# EasyEDA Pro project TY-PCB.eprj

# Schematic Schematic1
Create Date: 2023-03-30; Page Name: P1; Project Name: TY-PCB; Schematic Name: Schematic1; Update Date: 2023-04-24; Company: 嘉立创EDA; Page Size: A4; Version: V1.0
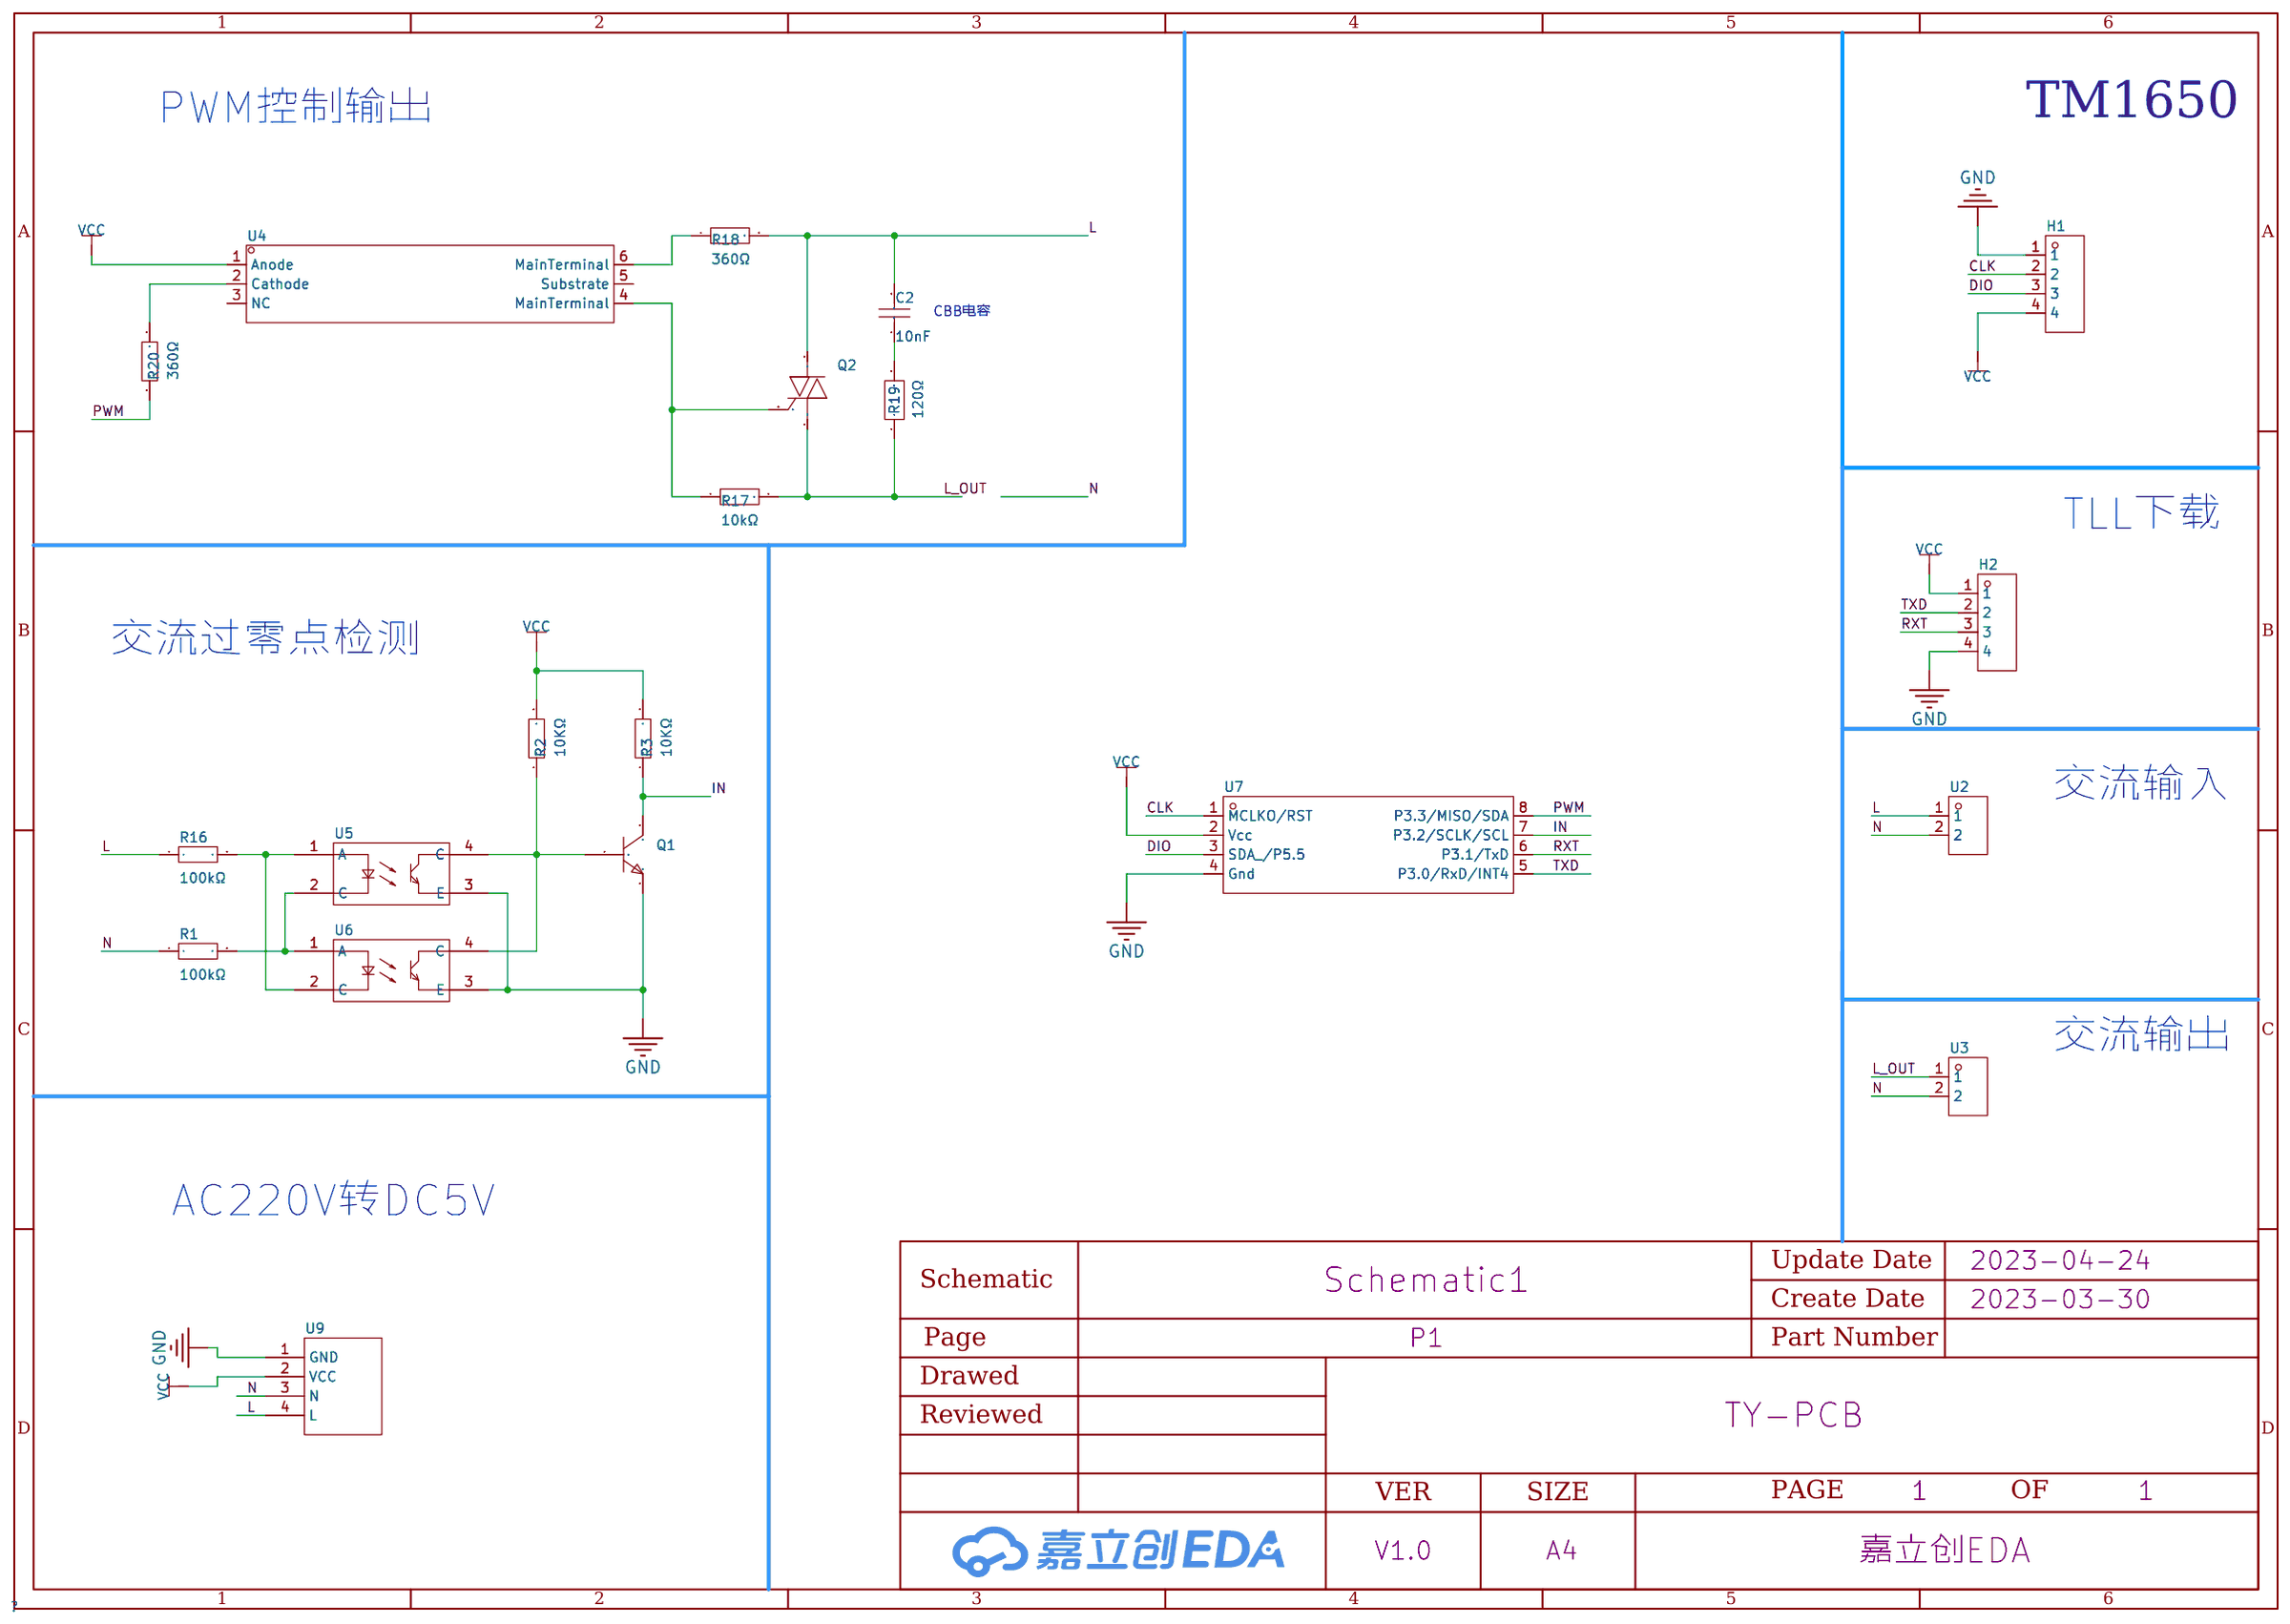
[diagram p0: schematic sheet]

## Parts
C2  10nF  [CAP-TH_L13.0-W6.0-P10.00-D1.2]
H1  826629-4  [HDR-TH_4P-P2.54-V-M-1]
H2  826629-4  [HDR-TH_4P-P2.54-V-M-1]
Q1  S8050  [TO-92-3_L4.9-W3.7-P1.27-L]
Q2  BTA06-800B  [TO-220-3_L10.0-W4.5-P2.54-L]
R1  100kΩ  [R1210]
R2  10KΩ  [R0805]
R3  10KΩ  [R0805]
R16  100kΩ  [R1210]
R17  10kΩ  [R1210]
R18  360Ω  [R1210]
R19  120Ω  [R2512]
R20  360Ω  [R0805]
U2  DB302-5.0-2P-GN-S  [CONN-TH_DB302-5.0-2P]
U3  DB302-5.0-2P-GN-S  [CONN-TH_DB302-5.0-2P]
U4  MOC3052S-V  [SOP-6_L8.5-W6.4-P2.54-LS9.2-BL]
U5  TLP521-1XGBSMT&R  [SOP-4_L6.4-W4.6-P2.54-LS10.2-BL]
U6  TLP521-1XGBSMT&R  [SOP-4_L6.4-W4.6-P2.54-LS10.2-BL]
U7  STC8G1K08-36I-SOP8  [SOP-8_L5.0-W4.0-P1.27-LS6.0-BL]
U9  -  [220V-5V]

## Library data of the parts
C2 = MPP103J2J1304075LC: 容值:10nF;精度:±5%;额定电压:-;; LCSC Part Name: 10nF ±5% CBB21金属膜电容; Supplier Part: C93289; Manufacturer: SRD(圣融达); Supplier Footprint: 插件; JLCPCB Part Class: Extended Part; Datasheet: https://atta.szlcsc.com/upload/public/pdf/source/20211112/7B10DD27AB297D99D7FD84A5C3A65F7C.pdf; Supplier: LCSC; Tolerance: ±5%; Operating Temperature: -40℃~+85℃
H1 H2 = 826629-4: 排数:单排;总PIN位数:4;间距:2.54mm;插针结构:1x4P;行距:-;安装类型:直插;圆针/方针:-;额定电流:-;额定电压:-;配合针长度:6.7mm;塑高:2.8mm;端接针长度:3.2mm;触头材质:-;工作温度范围:-;颜色:绿色;; LCSC Part Name: 2.54mm 1x4P 直插; Supplier Part: C590277; Manufacturer: TE Connectivity(美国泰科); Supplier Footprint: 插件,P=2.54mm; JLCPCB Part Class: Extended Part; Datasheet: https://atta.szlcsc.com/upload/public/pdf/source/20210923/FCC8CD9A04BA2624CF68C067B4A5B53A.pdf; Supplier: LCSC; Number of Rows: 单排; Number of Pins: 4; Pitch: 2.54mm; Pin Structure: 1x4P; Mounting Type: 直插; Length of Mating Pin: 6.7mm; Insulation Height: 2.8mm; Length of End Connection Pin: 3.2mm; Color: 绿色
Q1 = S8050_C141642: 晶体管类型:NPN;集射极击穿电压(Vceo):25V;集电极电流(Ic):500mA;功率(Pd):625mW;集电极截止电流(Icbo):100nA;集电极-发射极饱和电压(VCE(sat)@Ic,Ib):600mV@500mA,50mA;直流电流增益(hFE@Ic,Vce):120@50mA,1V;特征频率(fT):150MHz;工作温度:+150℃@(Tj);; LCSC Part Name: NPN 25V 500mA; Supplier Part: C141642; Manufacturer: CJ(江苏长电/长晶); Supplier Footprint: TO-92-3; JLCPCB Part Class: Extended Part; Datasheet: https://atta.szlcsc.com/upload/public/pdf/source/20171113/C141642_15105613285671115816.pdf; Supplier: LCSC; Transistor Type: NPN; Collector-Emitter Breakdown Voltage (Vceo): 25V; Collector Current (Ic): 500mA; Power Dissipation (Pd): 625mW; Collector Cut-Off Current (Icbo): 100nA; Collector-Emitter Saturation Voltage (VCE(sat)@Ic,Ib): 600mV@500mA,50mA; DC Current Gain (hFE@Ic,Vce): 120@50mA,1V; Transition Frequency (fT): 150MHz; Operating Temperature: +150℃@(Tj)
Q2 = BTA06-800B: LCSC Part Name: 双向可控硅BTA06-800B; Supplier Part: C2831698; Manufacturer: KY(韩景元); Supplier Footprint: TO-220; JLCPCB Part Class: Extended Part; Datasheet: https://atta.szlcsc.com/upload/public/pdf/source/20210520/C2831698_6947FF1BD28726FAFB3CC3B12FE84E61.pdf; Supplier: LCSC
R1 R16 = CR1210J30104G: 电阻类型:厚膜电阻;阻值:100kΩ;精度:±5%;功率:750mW;温度系数:±200ppm/℃;最大工作电压:200V;工作温度范围:-55℃~+125℃;; LCSC Part Name: 100kΩ ±5% 750mW; Supplier Part: C102402; Manufacturer: LIZ(丽智电子); Supplier Footprint: 1210; JLCPCB Part Class: Extended Part; Datasheet: https://atta.szlcsc.com/upload/public/pdf/source/20170408/1491635928596.pdf; Supplier: LCSC; Type: 厚膜电阻; Tolerance: ±5%; Power(Watts): 750mW; Temperature Coefficient: ±200ppm/℃; Overload Voltage (Max): 200V; Operating Temperature Range: -55℃~+125℃
R2 R3 R20 = 0805W8F1002T5E_C17414: 电阻类型:厚膜电阻;阻值:10kΩ;精度:±1%;功率:125mW;温度系数:±100ppm/℃;最大工作电压:150V;工作温度范围:-55℃~+155℃;; LCSC Part Name: 10kΩ ±1% 125mW; Supplier Part: C17414; Manufacturer: UNI-ROYAL(厚声); Manufacturer Part: 0805W8F1002T5E; Supplier Footprint: 0805; JLCPCB Part Class: Basic Part; Datasheet: https://atta.szlcsc.com/upload/public/pdf/source/20200306/C422600_1E6D84923E4A46A82E41ADD87F860B5C.pdf; Supplier: LCSC; Type: 厚膜电阻; Tolerance: ±1%; Power(Watts): 125mW; Temperature Coefficient: ±100ppm/℃; Overload Voltage (Max): 150V; Operating Temperature Range: -55℃~+155℃
R17 = RK73B2ETTD103J: 阻值:10kΩ;精度:±5%;功率:750mW;温度系数:±200ppm/℃;最大工作电压:200V;工作温度范围:-55℃~+155℃;; LCSC Part Name: 10kΩ ±5% 750mW; Supplier Part: C131365; Manufacturer: KOA; Supplier Footprint: 1210; JLCPCB Part Class: Extended Part; Datasheet: https://atta.szlcsc.com/upload/public/pdf/source/20170918/C131365_1505726912073976318.pdf; Supplier: LCSC; Tolerance: ±5%; Power(Watts): 750mW; Temperature Coefficient: ±200ppm/℃; Overload Voltage (Max): 200V; Operating Temperature Range: -55℃~+155℃
R18 = CR1210J30361G: 电阻类型:厚膜电阻;阻值:360Ω;精度:±5%;功率:750mW;温度系数:±200ppm/℃;最大工作电压:200V;工作温度范围:-55℃~+125℃;; LCSC Part Name: 360Ω ±5% 750mW; Supplier Part: C102460; Manufacturer: LIZ(丽智电子); Supplier Footprint: 1210; JLCPCB Part Class: Extended Part; Datasheet: https://atta.szlcsc.com/upload/public/pdf/source/20170408/1491635946391.pdf; Supplier: LCSC; Type: 厚膜电阻; Tolerance: ±5%; Power(Watts): 750mW; Temperature Coefficient: ±200ppm/℃; Overload Voltage (Max): 200V; Operating Temperature Range: -55℃~+125℃
R19 = RC2512JK-7W120RL: 阻值:120Ω;精度:±5%;功率:2W;最大工作电压:200V;工作温度范围:-55℃~+155℃;; LCSC Part Name: 120Ω ±5% 2W; Supplier Part: C2980091; Manufacturer: YAGEO(国巨); Supplier Footprint: 2512; JLCPCB Part Class: Extended Part; Datasheet: https://atta.szlcsc.com/upload/public/pdf/source/20200729/C77617_95A5CB0DA5B36E247059EF653C0CC0E3.pdf; Supplier: LCSC; Tolerance: ±5%; Power(Watts): 2W; Overload Voltage (Max): 200V; Operating Temperature Range: -55℃~+155℃
U2 U3 = DB302-5.0-2P-GN-S: LCSC Part Name: 2P P=5mm; Supplier Part: C2997275; Manufacturer: DIBO(地博电气); Supplier Footprint: P=5mm; JLCPCB Part Class: Extended Part; Datasheet: https://atta.szlcsc.com/upload/public/pdf/source/20220418/F63E4822E301FF035E2D9136E480A4B5.pdf; Supplier: LCSC
U4 = MOC3052S-V: 可控硅类型:双向可控硅;过零电路:无;输出通道数:1;正向电压:1.15V;正向电流:50mA;断态峰值电压(Vdrm):600V;静态dv/dt:1000V/us;输出电流(It(rms)):-;隔离电压(rms):5kV;工作温度:-40℃~+100℃;; Supplier Part: C343984; Manufacturer: LITEON(光宝); Supplier Footprint: SOP-6-2.54mm; JLCPCB Part Class: Extended Part; Datasheet: https://atta.szlcsc.com/upload/public/pdf/source/20181213/C343984_10A9A0070A89622C834B9DE197A5FA5C.pdf; Supplier: LCSC; SCR Type: 双向可控硅; Zero Crossing Circuit: 无; Number of Outputs: 1; Forward Voltage: 1.15V; Forward Current: 50mA; Peak Off-state Voltage(Vdrm): 600V; Static dv/dt: 1000V/us; Isolation Voltage(rms): 5kV; Operating Temperature: -40℃~+100℃
U5 U6 = TLP521-1XGBSMT&R: 输入电压类型:DC;输出类型:光电三极管;输出通道数:1;正向电压:1.15V;反向电压:6V;输出电流:-;接收端电压:55V;集射极饱和电压(Vce(sat)@Ic,IF):400mV@2.4mA,8mA;上升时间:4us@2mA,100Ω;下降时间:3us@2mA,100Ω;隔离电压(rms):5.3kV;工作温度:-30℃~+100℃;; LCSC Part Name: TLP521-1XGBSMT&R 卷带; Supplier Part: C722230; Manufacturer: ISOCOM(英国安数光); Supplier Footprint: SOP-4-2.54mm; JLCPCB Part Class: Extended Part; Datasheet: https://atta.szlcsc.com/upload/public/pdf/source/20180503/C191698_9968109D1D125A7F2CCDC343DA9E982F.pdf; Supplier: LCSC; Input voltage type: DC; Output Type: 光电三极管; Number of Outputs: 1; Forward Voltage: 1.15V; Reverse Voltage: 6V; Receiving End Voltage: 55V; Collector-Emitter Saturation Voltage (Vce(sat)@Ic,IF): 400mV@2.4mA,8mA; Rise time: 4us@2mA,100Ω; Fall time: 3us@2mA,100Ω; Isolation Voltage(rms): 5.3kV; Operating Temperature: -30℃~+100℃
U7 = STC8G1K08-36I-SOP8: CPU内核:51系列;CPU最大主频:-;程序存储容量:8KB;程序存储器类型:FLASH;RAM总容量:1.25KB;GPIO端口数量:6;ADC(位数):-;工作温度范围:-40℃~+85℃;; LCSC Part Name: 51系列; Supplier Part: C713818; Manufacturer: STC(宏晶); Supplier Footprint: SOP-8; JLCPCB Part Class: Extended Part; Datasheet: https://atta.szlcsc.com/upload/public/pdf/source/20201105/C713818_1666C7558605C197DBF08446D241F69F.pdf; Supplier: LCSC; CPU Core: 51系列; Operating Voltage Range: 1.9V~5.5V; Program Storage Size: 8KB; Program Memory Type: FLASH; RAM Size: 1.25KB; EEPROM: 8KB; GPIO Ports Number: 6; 16Bit Timer: 2; UART/USART: 1; I2C: 1; SPI: 1; Peripheral/Function: 低电压检测；看门狗；除法器；乘法器; Watchdog: 有; Low-Voltage Detect: 有; Internal Oscillator: 有; Operating Temperature Range: -40℃~+85℃
U9 = 220V-5V

## Nets
GND: H1.1 H2.4 Q1.1(E) U5.3(E) U6.3(E) U7.4(Gnd) U9.1(GND)
VCC: H1.4 H2.1 R2.2 R3.2 U4.1(Anode) U7.2(Vcc) U9.2(VCC)
CLK: H1.2 U7.1(MCLKO/RST)
DIO: H1.3 U7.3(SDA_/P5.5)
IN: Q1.3(C) R3.1 U7.7(P3.2/SCLK/SCL)
L: C2.2 Q2.2(M2) R16.1 R18.2 U2.1 U9.4(L)
L_OUT: Q2.1(M1) R17.2 R19.1 U3.1
N: R1.1 U2.2 U3.2 U9.3(N)
PWM: R20.1 U7.8(P3.3/MISO/SDA)
RXT: H2.3 U7.6(P3.1/TxD)
TXD: H2.2 U7.5(P3.0/RxD/INT4)
$1N2019: R20.2 U4.2(Cathode)
$1N7865: Q1.2(B) R2.1 U5.4(C) U6.4(C)
$1N8212: R1.2 U5.2(C) U6.1(A)
$1N8238: R16.2 U5.1(A) U6.2(C)
$1N8489: R18.1 U4.6(MainTerminal)
$1N8591: Q2.3(G) R17.1 U4.4(MainTerminal)
$1N10122: C2.1 R19.2

Not connected (* = marked no-connect by the designer): U4 3(NC) 5(Substrate)

## Notes on the sheet
- PWM控制输出
- TM1650
- CBB电容
- TLL下载
- 交流过零点检测
- 交流输入
- 交流输出
- AC220V转DC5V

# Board PCB1
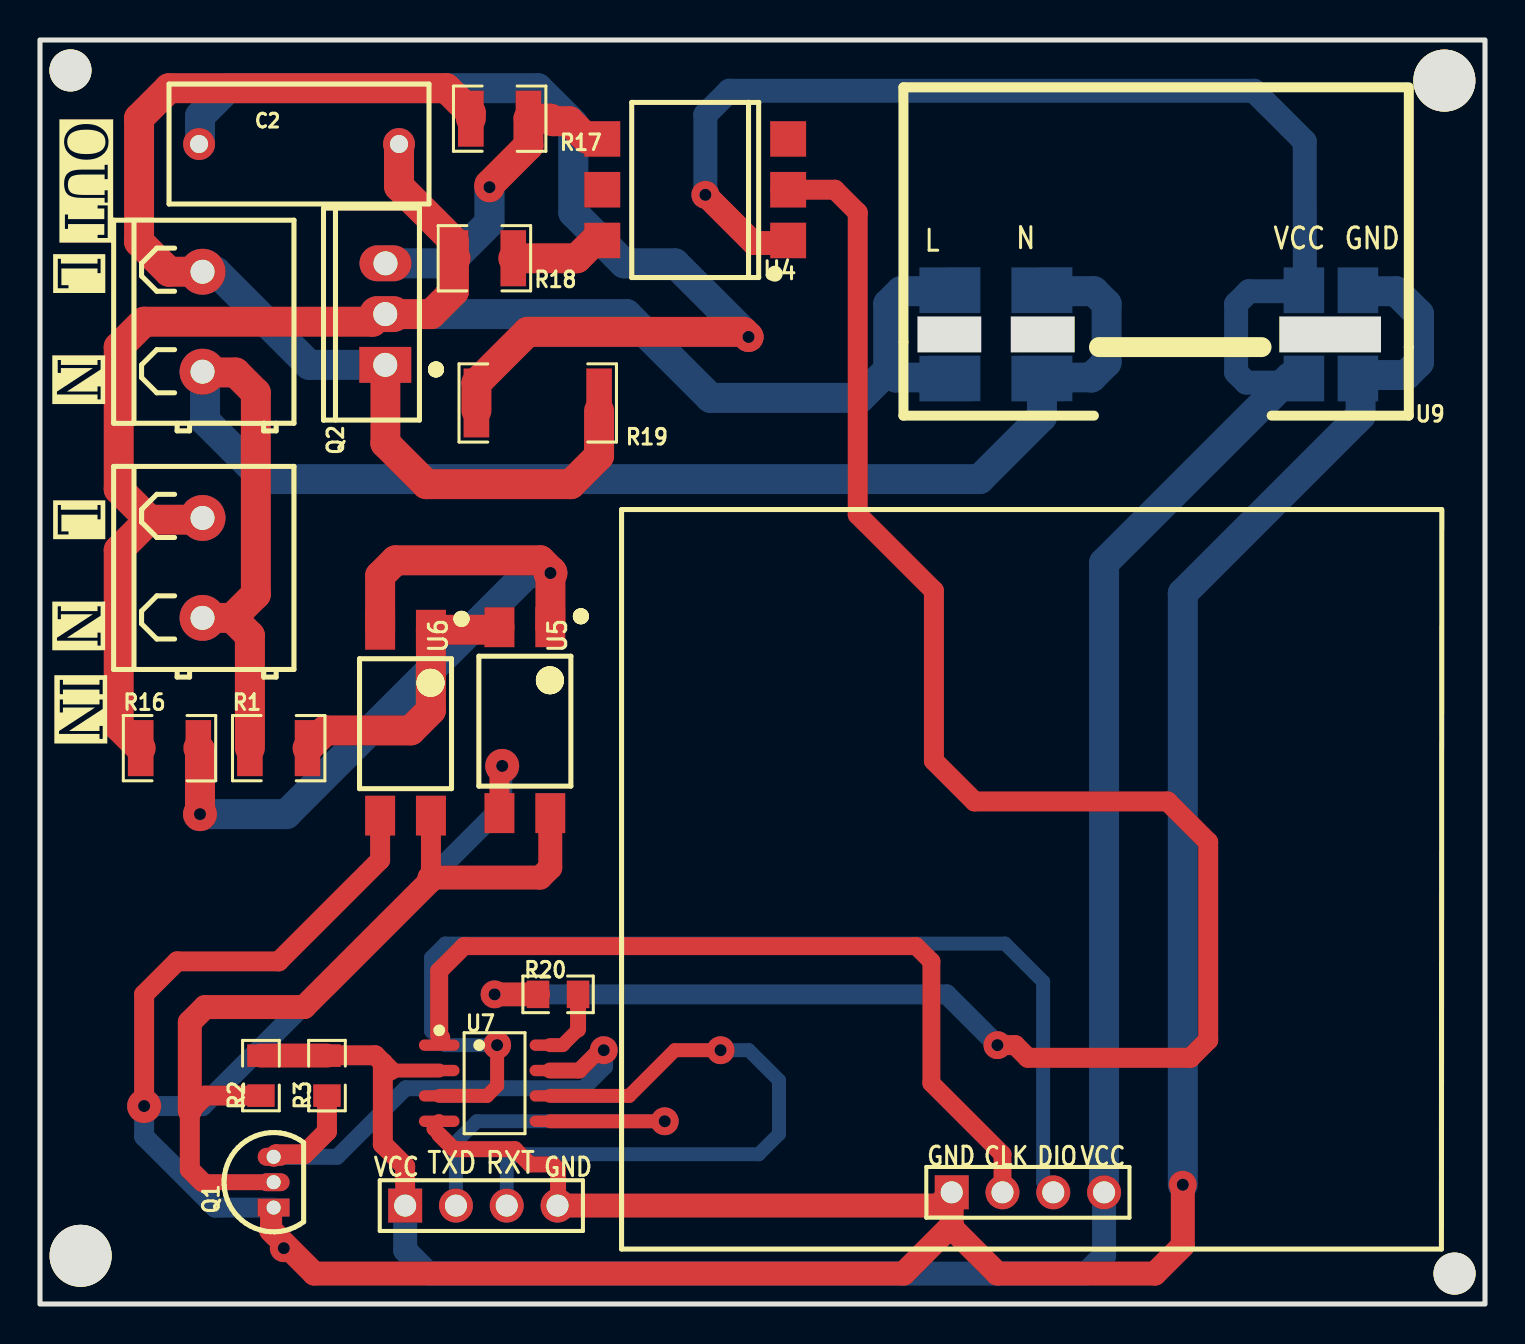
[diagram p1: board, top side]
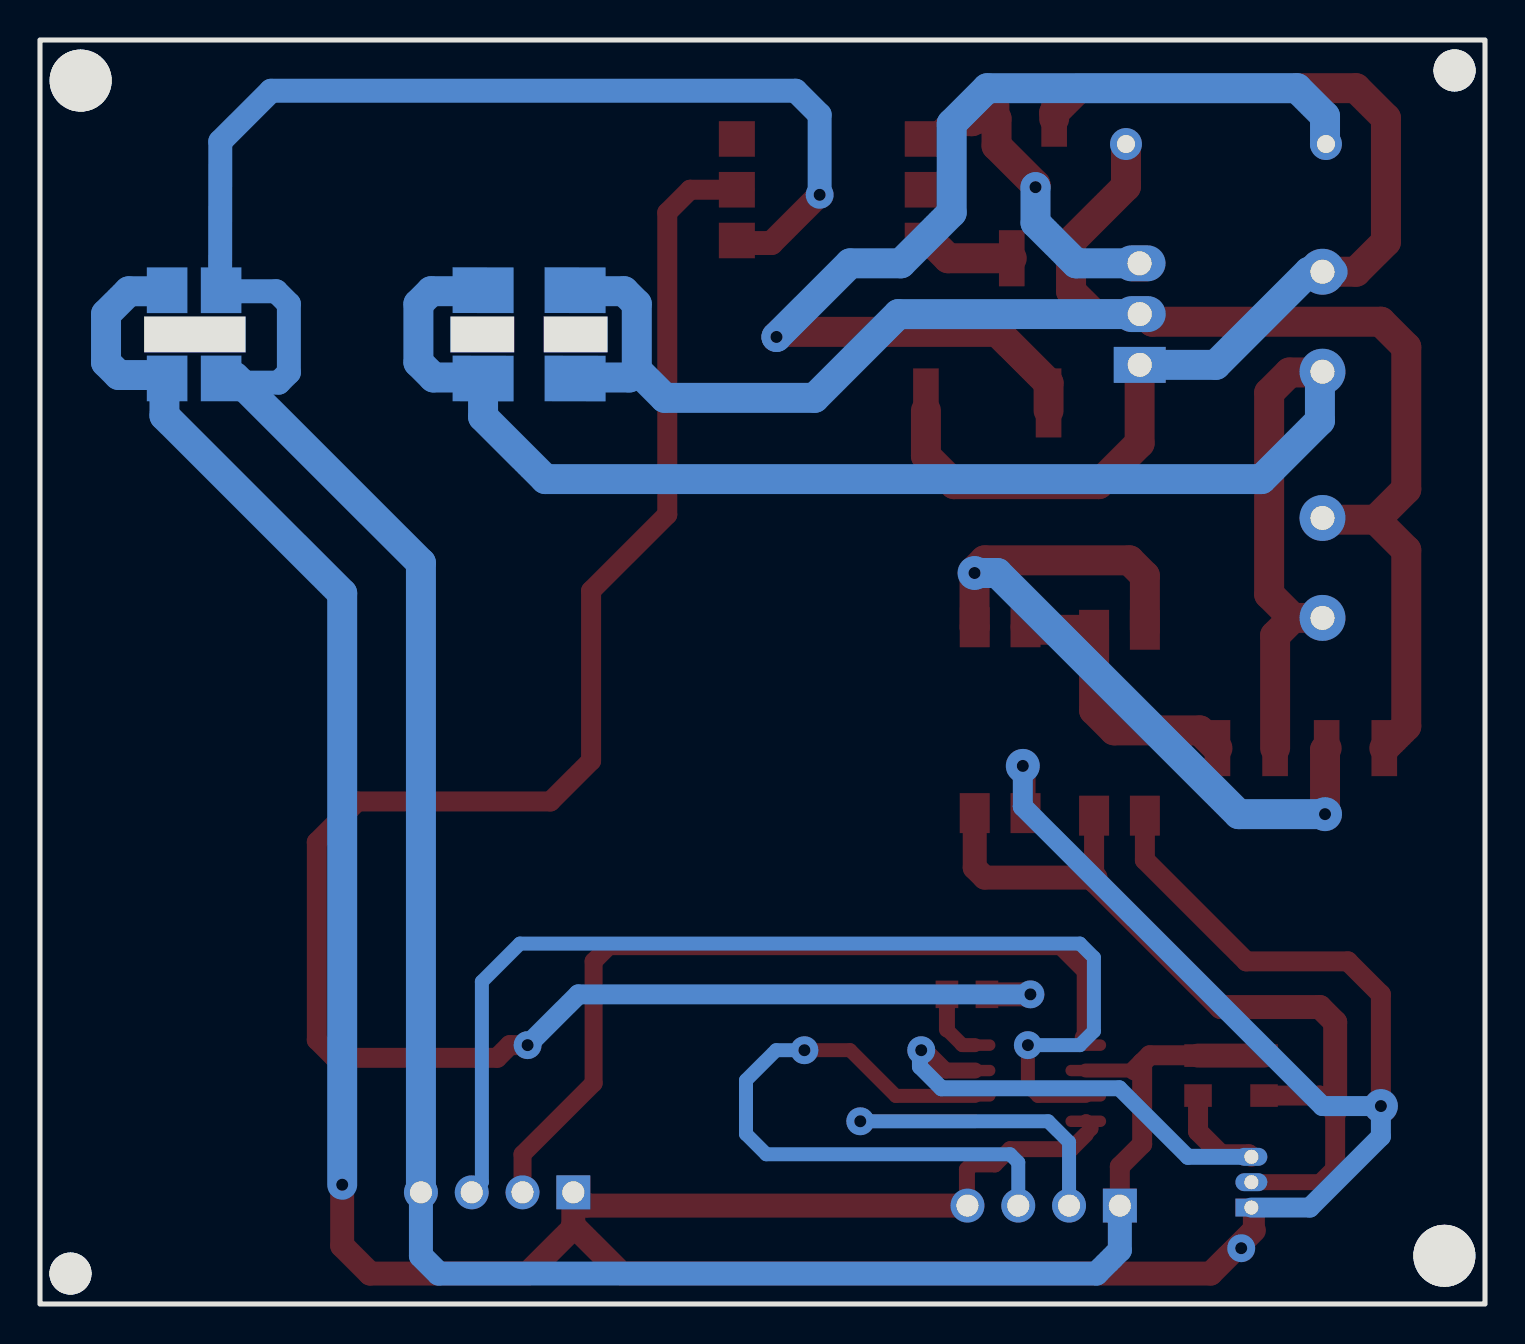
[diagram p2: board, bottom side, seen from below]

Outline 72.26 x 63.25 mm; copper layers: Top Layer, Bottom Layer. Coordinates in mm from the lower left corner of the outline.
Outline path: rectangle 0,63.25 72.26,0
Stack: Top Layer 0.035mm / Dielectric1 1.51mm FR4 er 4.5 / Bottom Layer 0.035mm

## Design rules (mm)
spacing safeClearance (default): track to track 0.152, other pairs 0.152 to 0.3
track width trackWidth (default): min 0.127, default 0.254, max 2.54
differential pair differentialPair (default): width min 0.127, default 0.254, max 2.54; gap min 0.152, default 0.152
via viaSize (default): diameter min 0.5, default 0.61, max 10; hole min 0.3, default 0.305, max 6

## Placement (name value [footprint] x y rotation side)
C2  10nF  [CAP-TH_L13.0-W6.0-P10.00-D1.2]  12.95 58.04 0 top
H1  826629-4  [HDR-TH_4P-P2.54-V-M-1]  49.4 5.59 0 top
H2  826629-4  [HDR-TH_4P-P2.54-V-M-1]  22.07 4.92 0 top
NOREF  -  [Pad_e312]  70.74 1.52 0 top
NOREF#2  -  [Pad_e294]  1.52 61.72 0 top
NOREF#3  -  [Pad_e292]  2.03 2.41 0 top
NOREF#4  -  [Pad_e305]  70.23 61.21 0 top
Q1  S8050  [TO-92-3_L4.9-W3.7-P1.27-L]  11.68 6.1 90 top
Q2  BTA06-800B  [TO-220-3_L10.0-W4.5-P2.54-L]  17.27 49.53 90 top
R1  100kΩ  [R1210]  11.94 27.81 0 top
R2  10KΩ  [R0805]  11.05 11.43 90 top
R3  10KΩ  [R0805]  14.35 11.43 90 top
R16  100kΩ  [R1210]  6.48 27.81 0 top
R17  10kΩ  [R1210]  22.99 59.31 180 top
R18  360Ω  [R1210]  22.22 52.32 180 top
R19  120Ω  [R2512]  24.89 45.08 180 top
R20  360Ω  [R0805]  25.91 15.49 180 top
U2  DB302-5.0-2P-GN-S  [CONN-TH_DB302-5.0-2P]  8.13 36.83 270 top
U3  DB302-5.0-2P-GN-S  [CONN-TH_DB302-5.0-2P]  8.13 49.15 270 top
U4  MOC3052S-V  [SOP-6_L8.5-W6.4-P2.54-LS9.2-BL]  32.77 55.75 90 top
U5  TLP521-1XGBSMT&R  [SOP-4_L6.4-W4.6-P2.54-LS10.2-BL]  24.25 29.21 180 top
U6  TLP521-1XGBSMT&R  [SOP-4_L6.4-W4.6-P2.54-LS10.2-BL]  18.28 29.09 180 top
U7  STC8G1K08-36I-SOP8  [SOP-8_L5.0-W4.0-P1.27-LS6.0-BL]  22.73 11.05 270 top
U9  -  [220V-5V]  52.71 50.8 180 top

## Footprints (pads in the part's own frame, mm; a bottom-side part is the same pattern mirrored in y, then rotated)
220V-5V
  custom 2.032x2.286 smd far side: 1(-13.2,4.49) 1(-13.2,0.077) 2(-10.5,4.49) 2(-10.5,0.077)
  custom 3.053x2.292 smd far side: 3(2.6,4.492) 3(2.6,0.074) 4(7.2,4.492) 4(7.2,0.074)
CAP-TH_L13.0-W6.0-P10.00-D1.2
  round 1.6 hole 0.9: 1(-5,0) 2(5,0)
CONN-TH_DB302-5.0-2P
  round 2.3 hole 1.2: 1(-2.5,0) 2(2.5,0)
HDR-TH_4P-P2.54-V-M-1
  rect 1.7x1.7 hole 1.1: 1(-3.81,0)
  round 1.7 hole 1.1: 2(-1.27,0) 3(1.27,0) 4(3.81,0)
Pad_e292
  round 3.1 hole 3.1: 1(0,0)
Pad_e294
  round 2.1 hole 2.1: 1(0,0)
Pad_e305
  round 3.1 hole 3.1: 1(0,0)
Pad_e312
  round 2.1 hole 2.1: 1(0,0)
R0805
  rect 1.133x1.377 smd: 1(-1,0) 2(1,0)
R1210
  rect 1.282x2.808 smd: 1(-1.441,0) 2(1.441,0)
R2512
  rect 1.282x3.456 smd: 1(-3.067,0) 2(3.067,0)
SOP-4_L6.4-W4.6-P2.54-LS10.2-BL
  rect 1.5x2 smd: 1(-1.27,-4.65) 2(1.27,-4.65) 3(1.27,4.65) 4(-1.27,4.65)
SOP-6_L8.5-W6.4-P2.54-LS9.2-BL
  rect 1.78x1.8 smd: 1(-2.54,-4.648) 2(0,-4.648) 3(2.54,-4.648) 4(2.54,4.648) 5(0,4.648) 6(-2.54,4.648)
SOP-8_L5.0-W4.0-P1.27-LS6.0-BL
  oval 0.574x2.035 smd: 1(-1.905,-2.768) 2(-0.635,-2.768) 3(0.635,-2.768) 4(1.905,-2.768) 5(1.905,2.768) 6(0.635,2.768) 7(-0.635,2.768) 8(-1.905,2.768)
TO-92-3_L4.9-W3.7-P1.27-L
  rect 0.9x1.6 hole 0.7: 1(-1.27,0)
  oval 0.9x1.6 hole 0.7: 2(0,0) 3(1.27,0)
TO-220-3_L10.0-W4.5-P2.54-L
  rect 1.8x2.6 hole 1.2: 1(-2.54,0.005)
  oval 1.8x2.6 hole 1.2: 2(0,0.005) 3(2.54,-0.005)

## Nets
As in the schematic.

Pads without a net: NOREF 1; NOREF#2 1; NOREF#3 1; NOREF#4 1; U4 3 5

## Via types
v1: diameter 1.4, hole 0.6, Top Layer to Bottom Layer, 9 vias
v2: diameter 1.7, hole 0.6, Top Layer to Bottom Layer, 4 vias
v3: diameter 1.5, hole 0.6, Top Layer to Bottom Layer, 2 vias

## Routing (per net, layer and track width the routed paths; a pad name or vN(x,y) marks a point on that pad's centre or on a via; arc(x,y) is an arc through that point)
GND: length 198
  Top Layer w0.7: U7.4 19.94,9.14 19.69,8.89 19.69,8.76 19.97,8.48 ; 11.56,4.7 Q1.1
  Top Layer w0.8: H2.4 25.91,4.95 25.91,6.73 25.65,6.98 24.51,6.98 23.75,7.75 20.7,7.75 19.97,8.48
  Top Layer w1: v2(23.11,26.92) 22.98,26.79 U5.3 ; v2(5.21,9.91) 5.21,15.49 6.86,17.14 11.94,17.14 17.01,22.22 U6.3
  Top Layer w1.1: 11.56,3.68 11.56,4.7
  Top Layer w1.2: 45.59,3.94 43.18,1.52 13.72,1.52 11.56,3.68 ; 45.59,3.94 H1.1 44.93,4.92 H2.4 ; 45.59,3.94 45.59,3.81 47.88,1.52 55.75,1.52 57.15,2.92 v1(57.15,5.97)
  Bottom Layer w1: Q1.1 8.76,4.83 5.21,8.38 v2(5.21,9.91) 8.13,9.91 23.11,24.89 v2(23.11,26.92)
  Bottom Layer w1.5: 66.04,50.67 67.82,50.67 68.96,49.53 68.96,47.12 68.33,46.48 66.12,46.48 66.04,46.4 66.04,44.45 57.15,35.56 v1(57.15,5.97)
  vias: v1(12.19,2.79)
VCC: length 160.7
  Top Layer w0.7: U7.2 17.53,11.68
  Top Layer w1: 17.15,12.06 16.76,12.45 14.37,12.45 R3.2 ; 17.15,12.06 17.53,11.68 ; 17.15,12.06 17.15,8 18.26,6.88 H2.1
  Top Layer w1.2: v1(33.27,55.5) 35.69,53.09 36.78,53.09 ; R3.2 R2.2
  Bottom Layer w1: 63.25,46.4 62.53,46.4
  Bottom Layer w1.2: v1(33.27,55.5) 33.27,59.51 34.47,60.71 60.71,60.71 63.25,58.17 63.25,50.67 60.45,50.67 59.82,50.04 59.82,46.61 60.32,46.1 62.23,46.1 ; H2.1 18.26,2.69 19.43,1.52 52.32,1.52 53.21,2.41 H1.4
  Bottom Layer w1.5: 62.53,46.4 53.21,37.08 H1.4
CLK: length 41.8
  Top Layer w0.9: 20.07,13.33 19.97,13.44 19.97,16.66 21.21,17.91 43.81,17.91 44.58,17.14 44.58,11.05 48.13,7.49 H1.2
DIO: length 54.8
  Top Layer w0.7: v1(22.86,12.95) 22.86,10.92 22.35,10.41 U7.3
  Bottom Layer w0.7: v1(22.86,12.95) 20.26,12.95 19.56,13.65 19.56,17.33 20.26,18.03 48.26,18.03 50.16,16.13 50.16,6.1 H1.3
IN: length 27.4
  Top Layer w0.8: U7.7 26.97,11.68 27.99,12.7 v1(28.19,12.7)
  Top Layer w1: R3.1 14.35,8.64 13.21,7.49 11.81,7.49 Q1.3
  Bottom Layer w0.8: Q1.3 14.86,7.37 18.29,10.79 27.18,10.79 28.26,11.87 28.26,12.64 v1(28.19,12.7)
L: length 88.3
  Top Layer w1.5: 20.7,53.17 17.95,55.92 C2.2 ; 5.46,39.24 3.94,40.77 3.94,47.88 5.21,49.15 16.63,49.15 17.01,49.53 19.56,49.53 20.7,50.67 20.7,52.41 ; 5.46,39.24 3.94,37.72 3.94,28.91 R16.1 ; 5.46,39.24 8.04,39.24 U2.1 ; R18.2 20.7,52.41 ; 20.7,52.41 20.7,53.09
  Bottom Layer w1.5: 42.42,46.74 41.02,45.34 33.53,45.34 29.34,49.53 Q2.2 ; 42.42,46.74 42.8,46.36 45.5,46.36 ; 42.42,46.74 42.42,50.04 43.06,50.68 45.5,50.68
L_OUT: length 57.9
  Top Layer w1.5: 27.96,44.7 27.96,42.44 26.54,41.02 19.32,41.02 17.27,43.07 17.27,46.98 Q2.1 ; U3.1 6.45,51.65 4.95,53.15 4.95,59.33 6.45,60.83 20.32,60.83 21.55,59.61 R17.2
  Bottom Layer w1.5: 7.62,51.65 8.8,51.65 13.46,46.99 Q2.1
N: length 82
  Top Layer w1.5: 9.61,34.33 10.8,35.51 10.8,45.59 9.78,46.61 8.17,46.61 U3.2 ; 9.61,34.33 10.5,33.44 R1.1 ; 9.61,34.33 U2.2
  Bottom Layer w1.5: U3.2 8.25,46.52 8.25,44.2 11.18,41.27 46.99,41.27 50.1,44.39 50.1,46.36 52.58,46.36 53.34,47.12 53.34,50.04 52.7,50.68 50.1,50.68
PWM: length 3.5
  Top Layer w0.7: 26.91,13.73 26.13,12.95 U7.8
  Top Layer w0.8: 26.91,13.73 R20.1
RXT: length 32.1
  Top Layer w0.7: U7.6 29.46,10.41 31.75,12.7 v1(34.04,12.7)
  Bottom Layer w0.7: v1(34.04,12.7) 35.45,12.7 36.96,11.19 36.96,8.51 35.94,7.49 23.75,7.49 23.34,7.09 H2.3
TXD: length 19.8
  Top Layer w0.7: v1(31.24,9.14) U7.5
  Bottom Layer w0.7: v1(31.24,9.14) 21.84,9.14 20.8,8.1 H2.2
$1N2019: length 98.2
  Top Layer w1: 37.03,55.75 39.75,55.75 40.89,54.61 40.89,39.5 44.7,35.69 44.7,27.18 46.74,25.15 56.39,25.15 58.42,23.11 58.42,13.21 57.53,12.32 49.4,12.32 48.77,12.95 v1(47.88,12.95)
  Top Layer w1.2: R20.2 v1(22.73,15.49)
  Bottom Layer w1: v1(22.73,15.49) 45.34,15.49 v1(47.88,12.95)
$1N7865: length 42.9
  Top Layer w0.8: 8.13,6.1 Q1.2
  Top Layer w1: R2.1 8.27,10.43 7.49,9.65 7.49,6.73 8.13,6.1 ; U6.4 19.55,21.4 19.48,21.34
  Top Layer w1.2: 7.49,9.65 7.49,14.1 8.25,14.86 13.21,14.86 19.48,21.14 19.48,21.34 25.02,21.34 25.52,21.84 U5.4
$1N8212: length 14.5
  Top Layer w1.5: U5.2 22.85,33.74 U6.1 19.55,29.71 18.54,28.7 14.27,28.7 R1.2
$1N8238: length 40.5
  Top Layer w1.5: v2(8,24.51) 8,27.73 R16.2 ; U6.2 17.01,36.44 17.78,37.21 25.02,37.21 25.53,36.7 25.53,33.87 U5.1
  Bottom Layer w1.5: v2(8,24.51) 12.32,24.51 24.38,36.58 v2(25.53,36.58)
$1N8489: length 4.4
  Top Layer w1.5: R18.1 26.85,52.32 27.74,53.21
$1N8591: length 15.4
  Top Layer w1.5: v3(22.48,55.88) 22.48,56.01 24.43,57.96 R17.1 25.53,59.31 25.65,59.18 26.47,59.18 27.36,58.29
  Bottom Layer w1.5: v3(22.48,55.88) 22.48,54.1 20.45,52.07 17.28,52.07
$1N10122: length 53.3
  Top Layer w1.5: 21.83,44.7 21.83,46.08 24.38,48.64 35.18,48.64 v3(35.43,48.39)
  Bottom Layer w1.5: v3(35.43,48.39) 31.75,52.07 29.21,52.07 26.67,54.61 26.67,59.05 24.89,60.83 9.4,60.83 8,59.44 8,58.09 C2.1

## Text on the board
Top Silkscreen Layer: VCC | GND | CLK | DIO | TXD | RXT | L | N | IN | OUT
